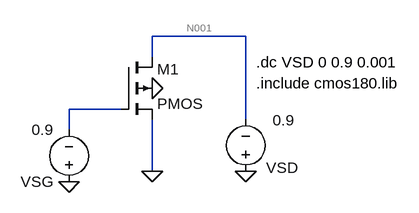
[diagram p0: schematic lamdaP.asc]
lamdaP.asc, the LTspice schematic file:
Version 4
SHEET 1 880 680
WIRE 352 96 208 96
WIRE 208 128 208 96
WIRE 160 208 80 208
WIRE 352 224 352 96
WIRE 80 240 80 208
WIRE 208 304 208 224
FLAG 352 304 0
FLAG 208 304 0
FLAG 80 320 0
FLAG 208 176 0
SYMBOL pmos4 160 128 R0
WINDOW 0 56 19 Left 2
SYMATTR InstName M1
SYMATTR Value2 l=1u w=1u
SYMBOL voltage 80 336 R180
WINDOW 123 0 0 Left 2
WINDOW 39 0 0 Left 2
SYMATTR InstName VSG
SYMATTR Value 0.9
SYMBOL voltage 352 320 R180
WINDOW 123 0 0 Left 2
WINDOW 39 0 0 Left 2
WINDOW 0 -80 22 Left 2
WINDOW 3 -75 95 Left 2
SYMATTR InstName VSD
SYMATTR Value 0.9
TEXT 368 168 Left 2 !.include cmos180.lib
TEXT 368 136 Left 2 !.dc VSD 0 0.9 0.001

The netlist it stands for:
* lamdaP.asc
M1 N001 N002 0 0 PMOS l=1u w=1u
VSG 0 N002 0.9
VSD 0 N001 0.9
.model NMOS NMOS
.model PMOS PMOS
.lib standard.mos
.include cmos180.lib
.dc VSD 0 0.9 0.001
.backanno
.end

* Results of the author's LTspice run, read from the files saved beside the schematic
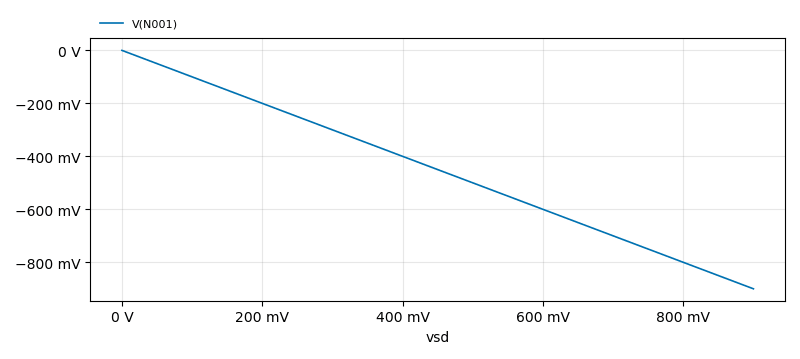
[diagram p1: DC transfer characteristic of lamdaP.asc, plotted from the saved traces]
* DC transfer characteristic, 1 run:
*   V(N001): 0 V at vsd=0 V, -900 mV at vsd=900 mV, min -900 mV, max 0 V